# EasyEDA schematic 1-Schematic_CJ4 Electrical Panel.json
TITLE: CJ4 PFD Menu panel; REV: 1.0; Date: 2021-06-11; Sheet: 1/1; Drawn By: Tuomas Kuosmanen; Company: Your Company
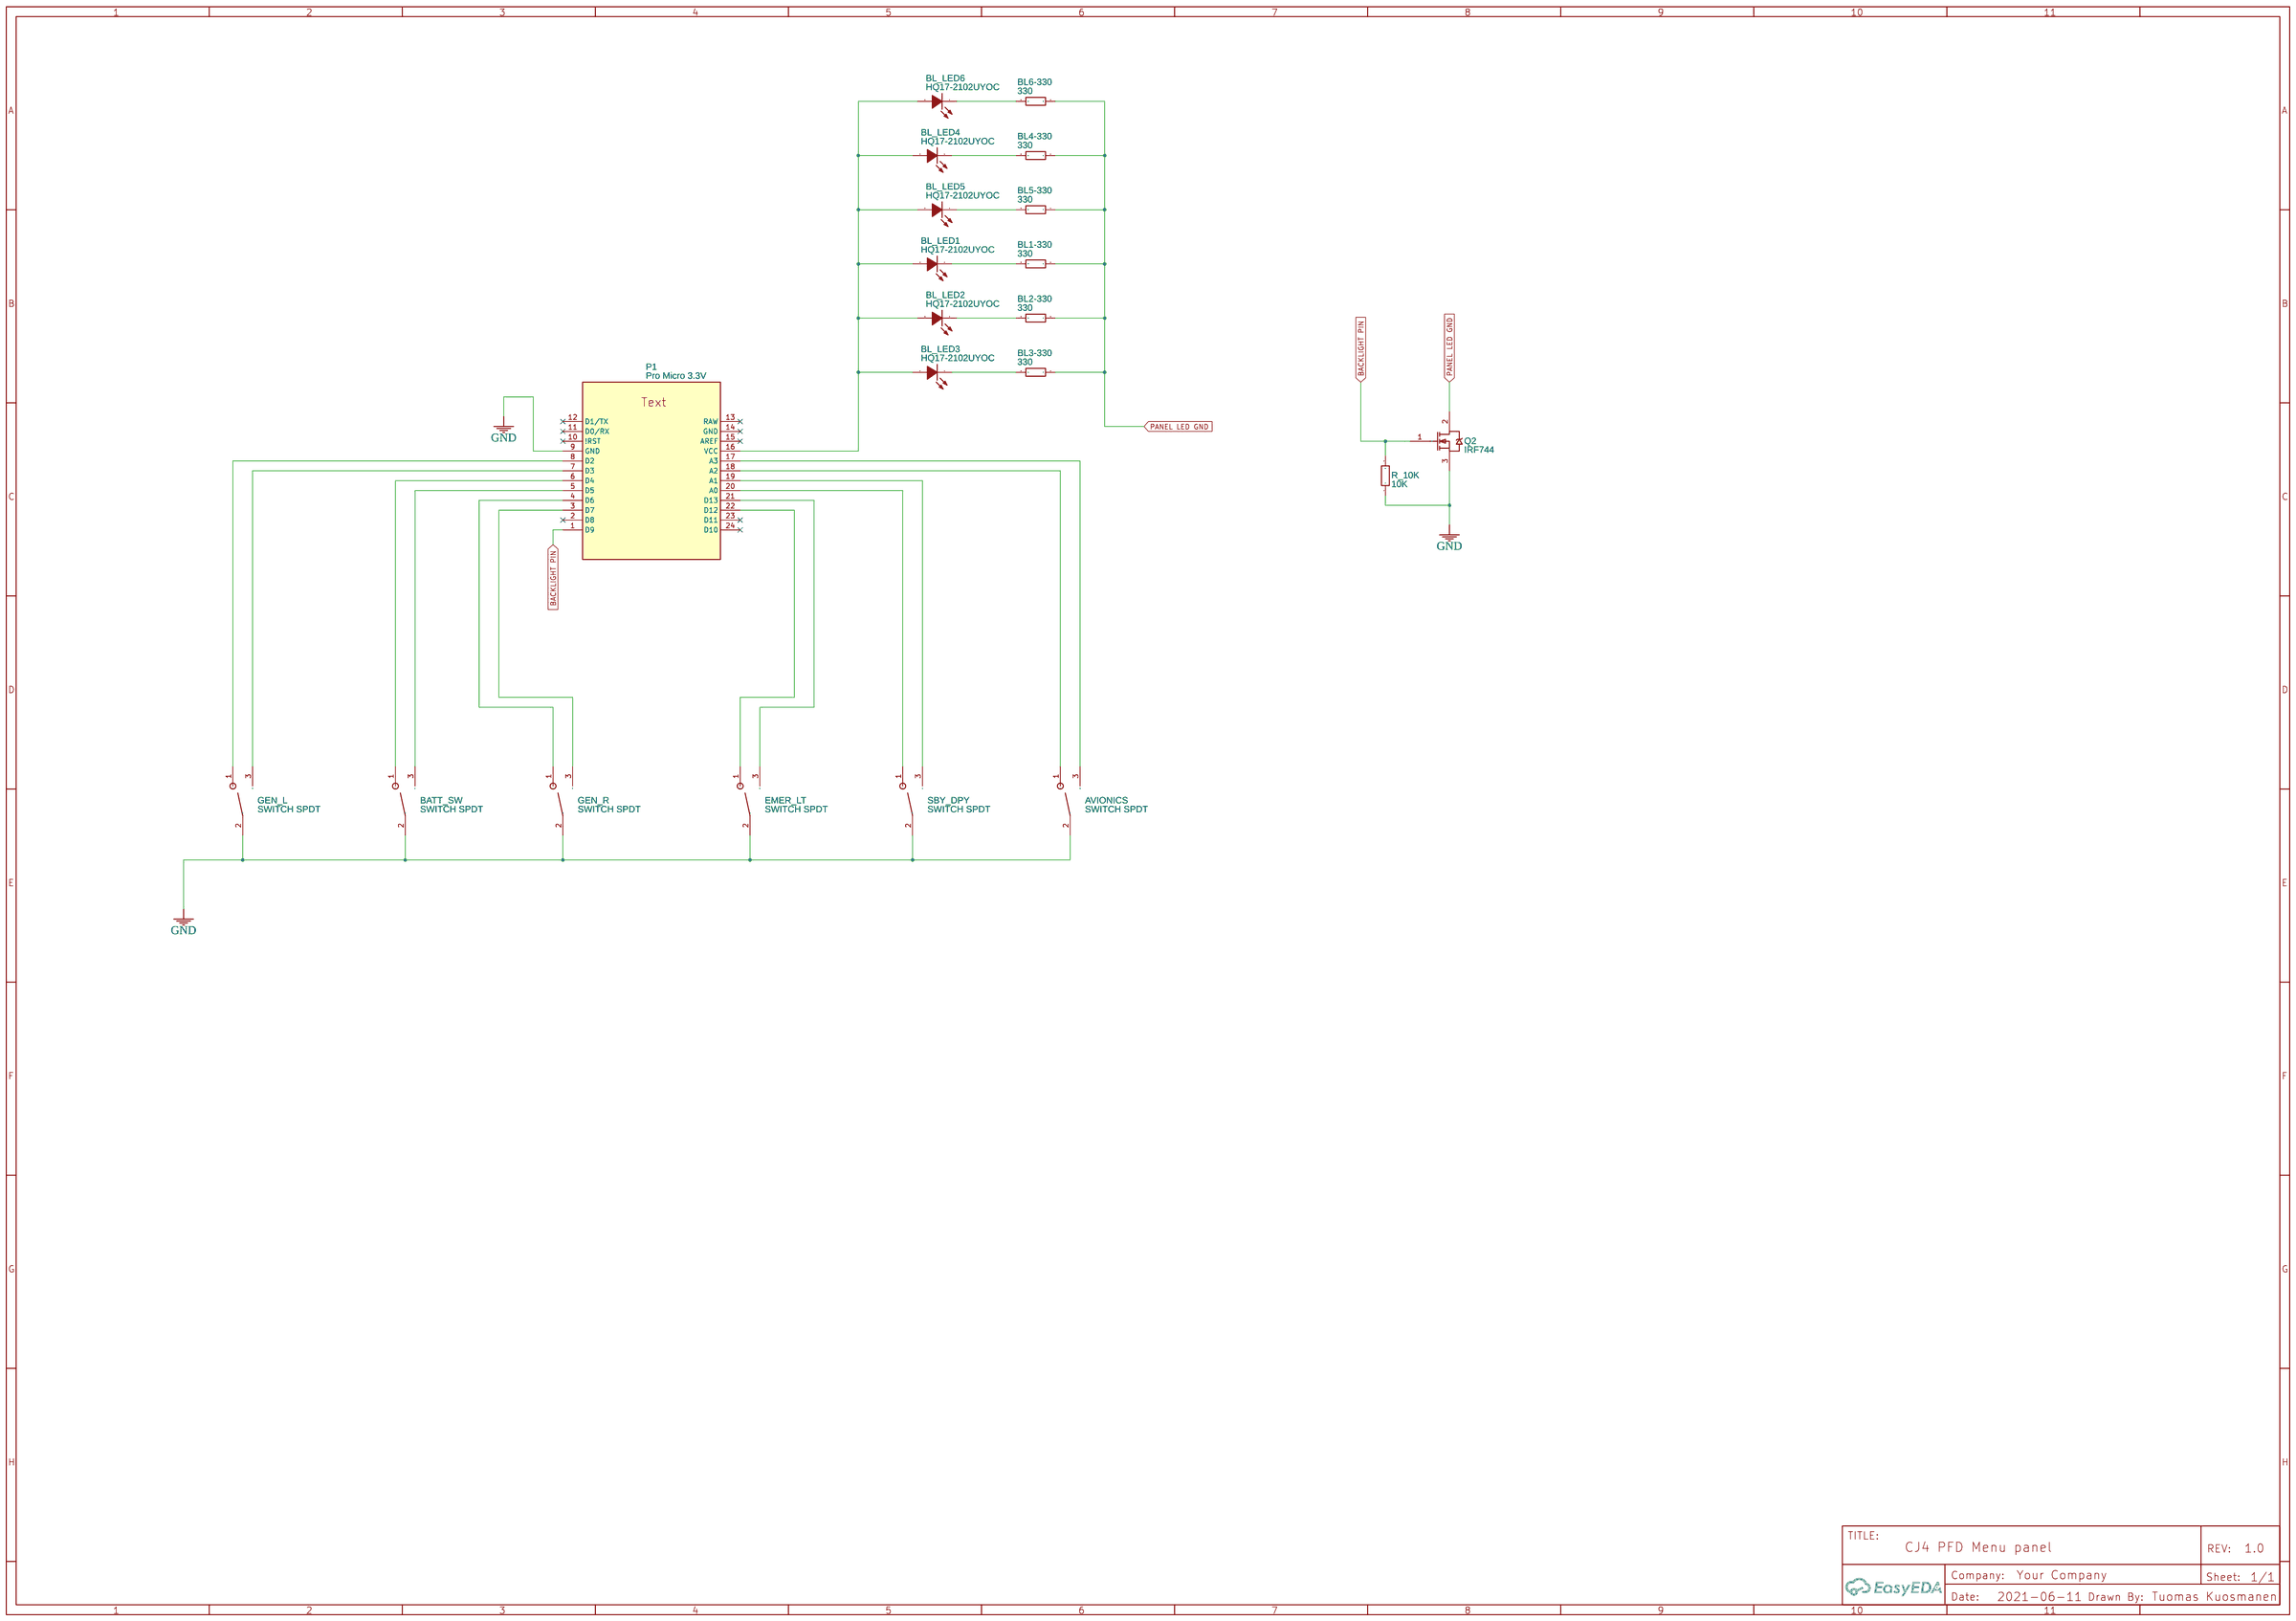
[diagram p0: schematic sheet]

## Parts
AVIONICS  SWITCH SPDT  [SWITCH_SALECOM_T8013_SEBQ_H]
BATT_SW  SWITCH SPDT  [SWITCH_SALECOM_T8013_SEBQ_H]
BL1-330  330  [R1206]
BL2-330  330  [R1206]
BL3-330  330  [R1206]
BL4-330  330  [R1206]
BL5-330  330  [R1206]
BL6-330  330  [R1206]
BL_LED1  HQ17-2102UYOC  [LED1206-RD]
BL_LED2  HQ17-2102UYOC  [LED1206-RD]
BL_LED3  HQ17-2102UYOC  [LED1206-RD]
BL_LED4  HQ17-2102UYOC  [LED1206-RD]
BL_LED5  HQ17-2102UYOC  [LED1206-RD]
BL_LED6  HQ17-2102UYOC  [LED1206-RD]
EMER_LT  SWITCH SPDT  [SWITCH_SALECOM_T8013_SEBQ_H]
GEN_L  SWITCH SPDT  [SWITCH_SALECOM_T8013_SEBQ_H]
GEN_R  SWITCH SPDT  [SWITCH_SALECOM_T8013_SEBQ_H]
P1  Pro Micro 3.3V  [PRO MICRO 3.3V]
Q2  IRF744  [TO-220AB]
R_10K  10K  [R1206]
SBY_DPY  SWITCH SPDT  [SWITCH_SALECOM_T8013_SEBQ_H]

## Library data of the parts
AVIONICS BATT_SW EMER_LT GEN_L GEN_R SBY_DPY = SWITCH SPDT: Supplier: LCSC; Supplier Part: C273365; Manufacturer: E-Switch; Manufacturer Part: 200MSP1T1B1M2QEH; Contributor: LCSC
BL1-330 BL2-330 BL3-330 BL4-330 BL5-330 BL6-330 R_10K = 1206W4J0331T5E: Supplier: LCSC; Manufacturer: UniOhm; Supplier Part: C25374
BL_LED1-BL_LED6 = HQ17-2102UYOC: Supplier: LCSC; Manufacturer: HARVATEK; Contributor: LCSC; Supplier Part: C154481; JLCPCB Part Class: Extended Part
P1 = Pro Micro 3.3V: sourceId: UbZz96Gge; Supplier Part: 12587; Supplier: SparkFun
Q2 = IRF744: HEXFET N-Channel Power MOSFET

## Nets
GND: AVIONICS.2 BATT_SW.2 EMER_LT.2 GEN_L.2 GEN_R.2 P1.9(GND) Q2.3(S) R_10K.1 SBY_DPY.2
BACKLIGHT PIN: P1.1(D9) Q2.1(G) R_10K.2
PANEL LED GND: BL1-330.1 BL2-330.1 BL3-330.1 BL4-330.1 BL5-330.1 BL6-330.1 Q2.2(D)
Net-(AVIONICS-1): AVIONICS.1 P1.18(A2)
Net-(AVIONICS-3): AVIONICS.3 P1.17(A3)
Net-(BATT_SW-1): BATT_SW.1 P1.6(D4)
Net-(BATT_SW-3): BATT_SW.3 P1.5(D5)
Net-(BL1-330-2): BL1-330.2 BL_LED1.1(K)
Net-(BL2-330-2): BL2-330.2 BL_LED2.1(K)
Net-(BL3-330-2): BL3-330.2 BL_LED3.1(K)
Net-(BL4-330-2): BL4-330.2 BL_LED4.1(K)
Net-(BL5-330-2): BL5-330.2 BL_LED5.1(K)
Net-(BL6-330-2): BL6-330.2 BL_LED6.1(K)
Net-(BL_LED1-2): BL_LED1.2(A) BL_LED2.2(A) BL_LED3.2(A) BL_LED4.2(A) BL_LED5.2(A) BL_LED6.2(A) P1.16(VCC)
Net-(EMER_LT-1): EMER_LT.1 P1.22(D12)
Net-(EMER_LT-3): EMER_LT.3 P1.21(D13)
Net-(GEN_L-1): GEN_L.1 P1.8(D2)
Net-(GEN_L-3): GEN_L.3 P1.7(D3)
Net-(GEN_R-1): GEN_R.1 P1.4(D6)
Net-(GEN_R-3): GEN_R.3 P1.3(D7)
Net-(P1-19): P1.19(A1) SBY_DPY.3
Net-(P1-20): P1.20(A0) SBY_DPY.1

Not connected (* = marked no-connect by the designer): P1 2(D8)* 10(!RST)* 11(D0/RX)* 12(D1/TX)* 13(RAW)* 14(GND)* 15(AREF)* 23(D11)* 24(D10)*
